# Altium schematic sheet 201_USB3Hub.SchDoc: USB Control Hub
size A2; Organization: Greenfield Tech Solutions; Address1: Molendreef 33; Address2: Ossendrecht; Address3: 4641CS; Address4: The Netherlands; SheetNumber: 3; SheetTotal: 8
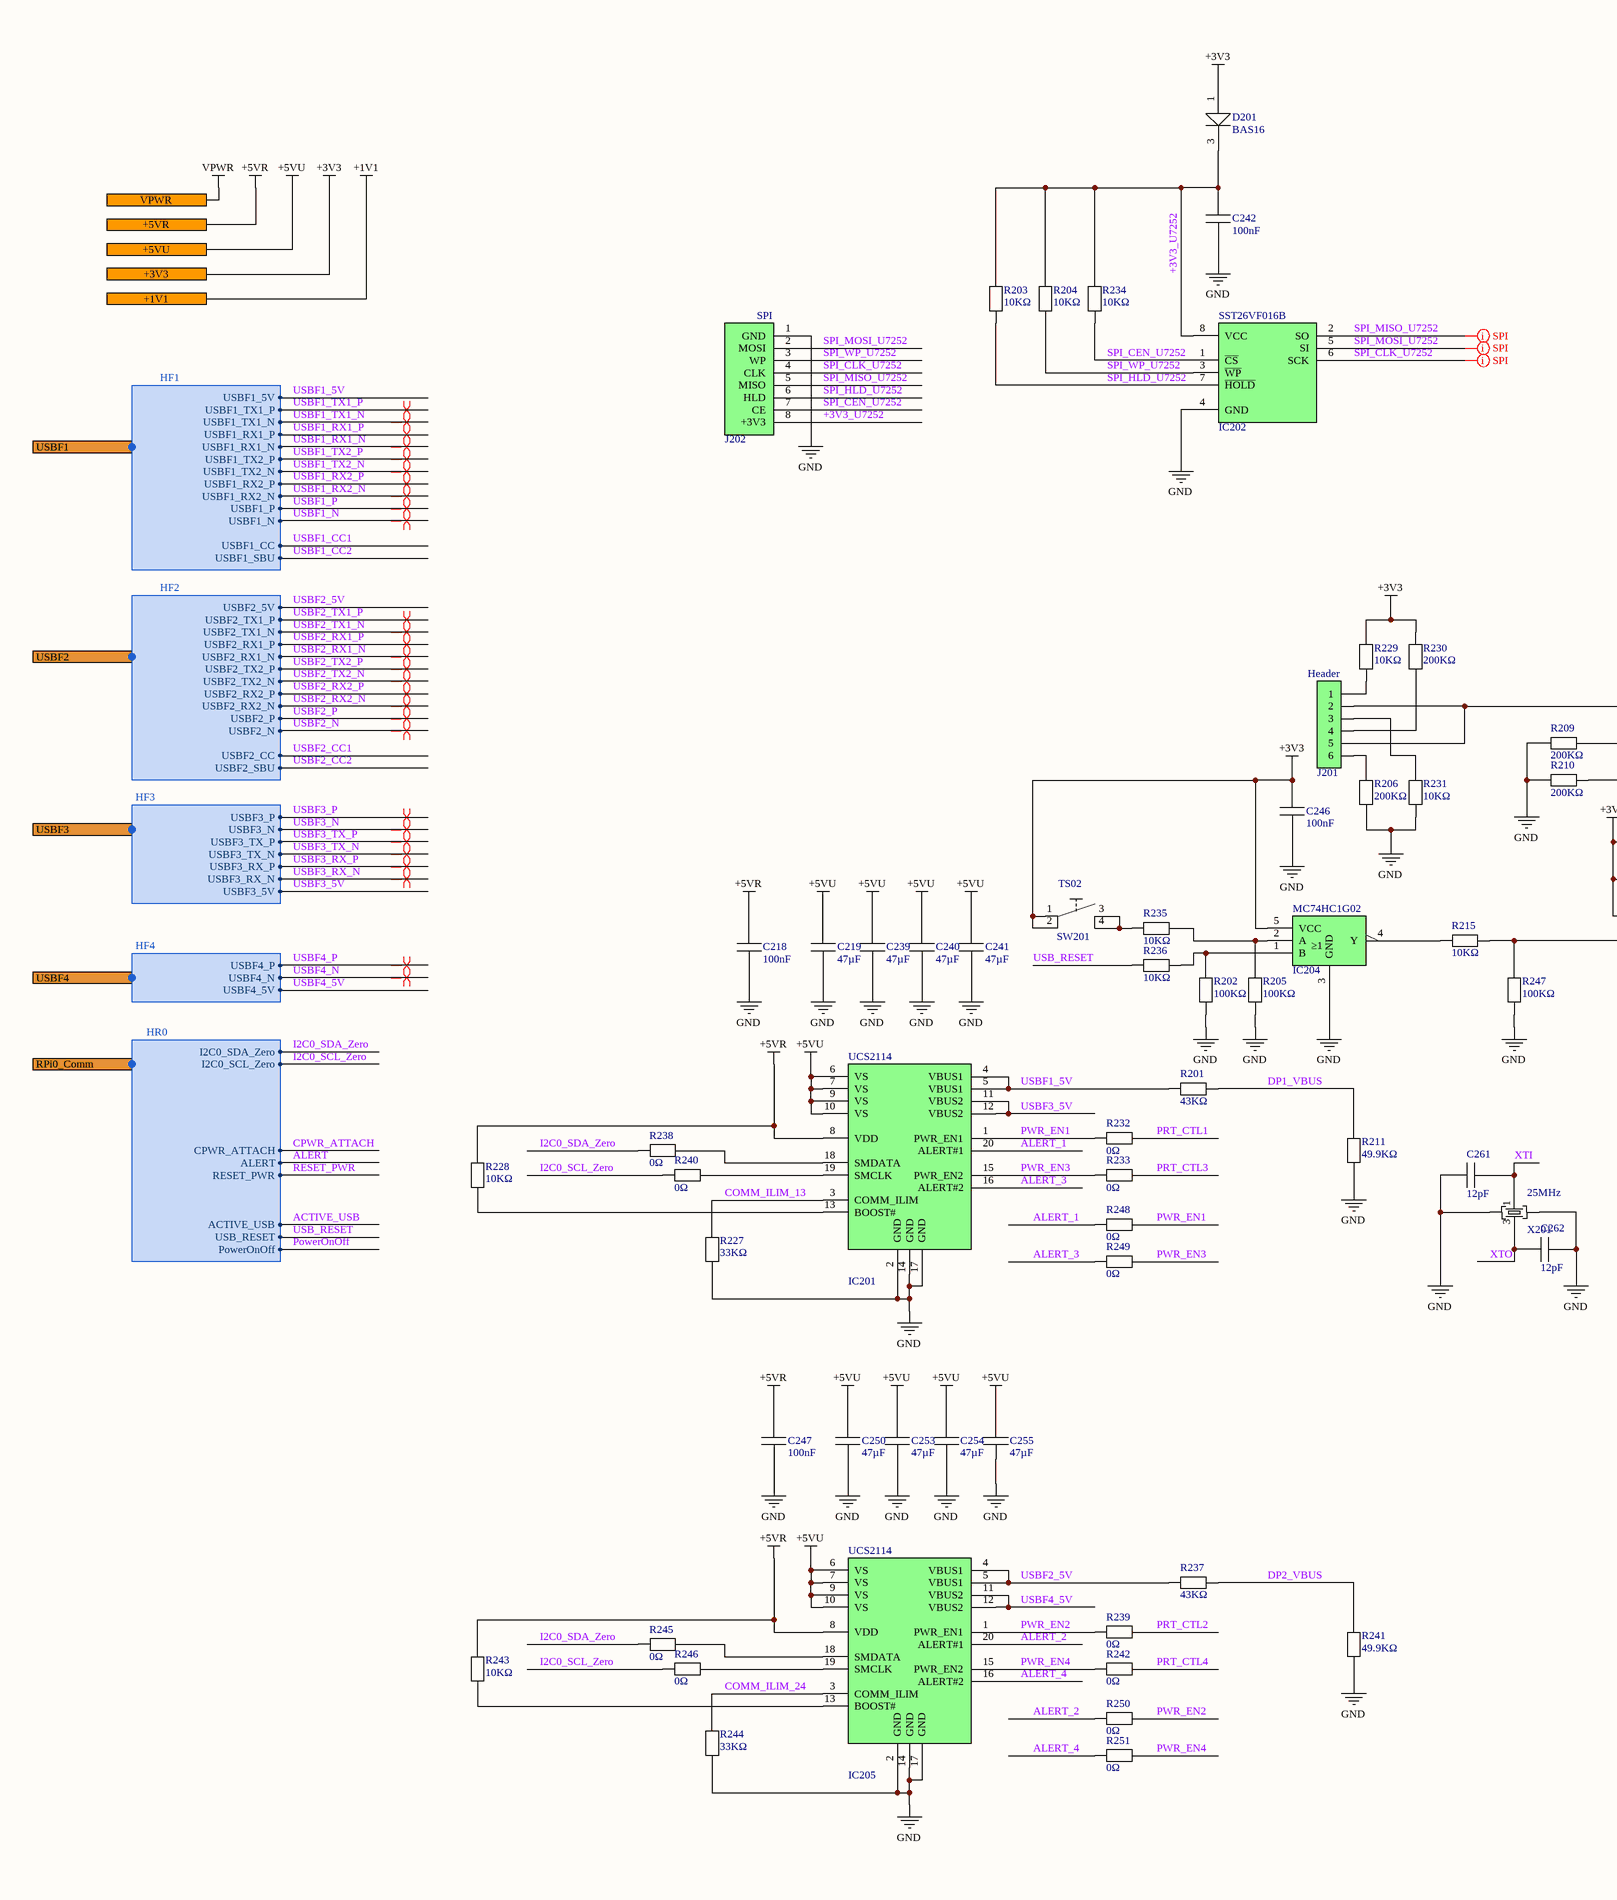
[diagram p0: 201_USB3Hub.SchDoc, left]
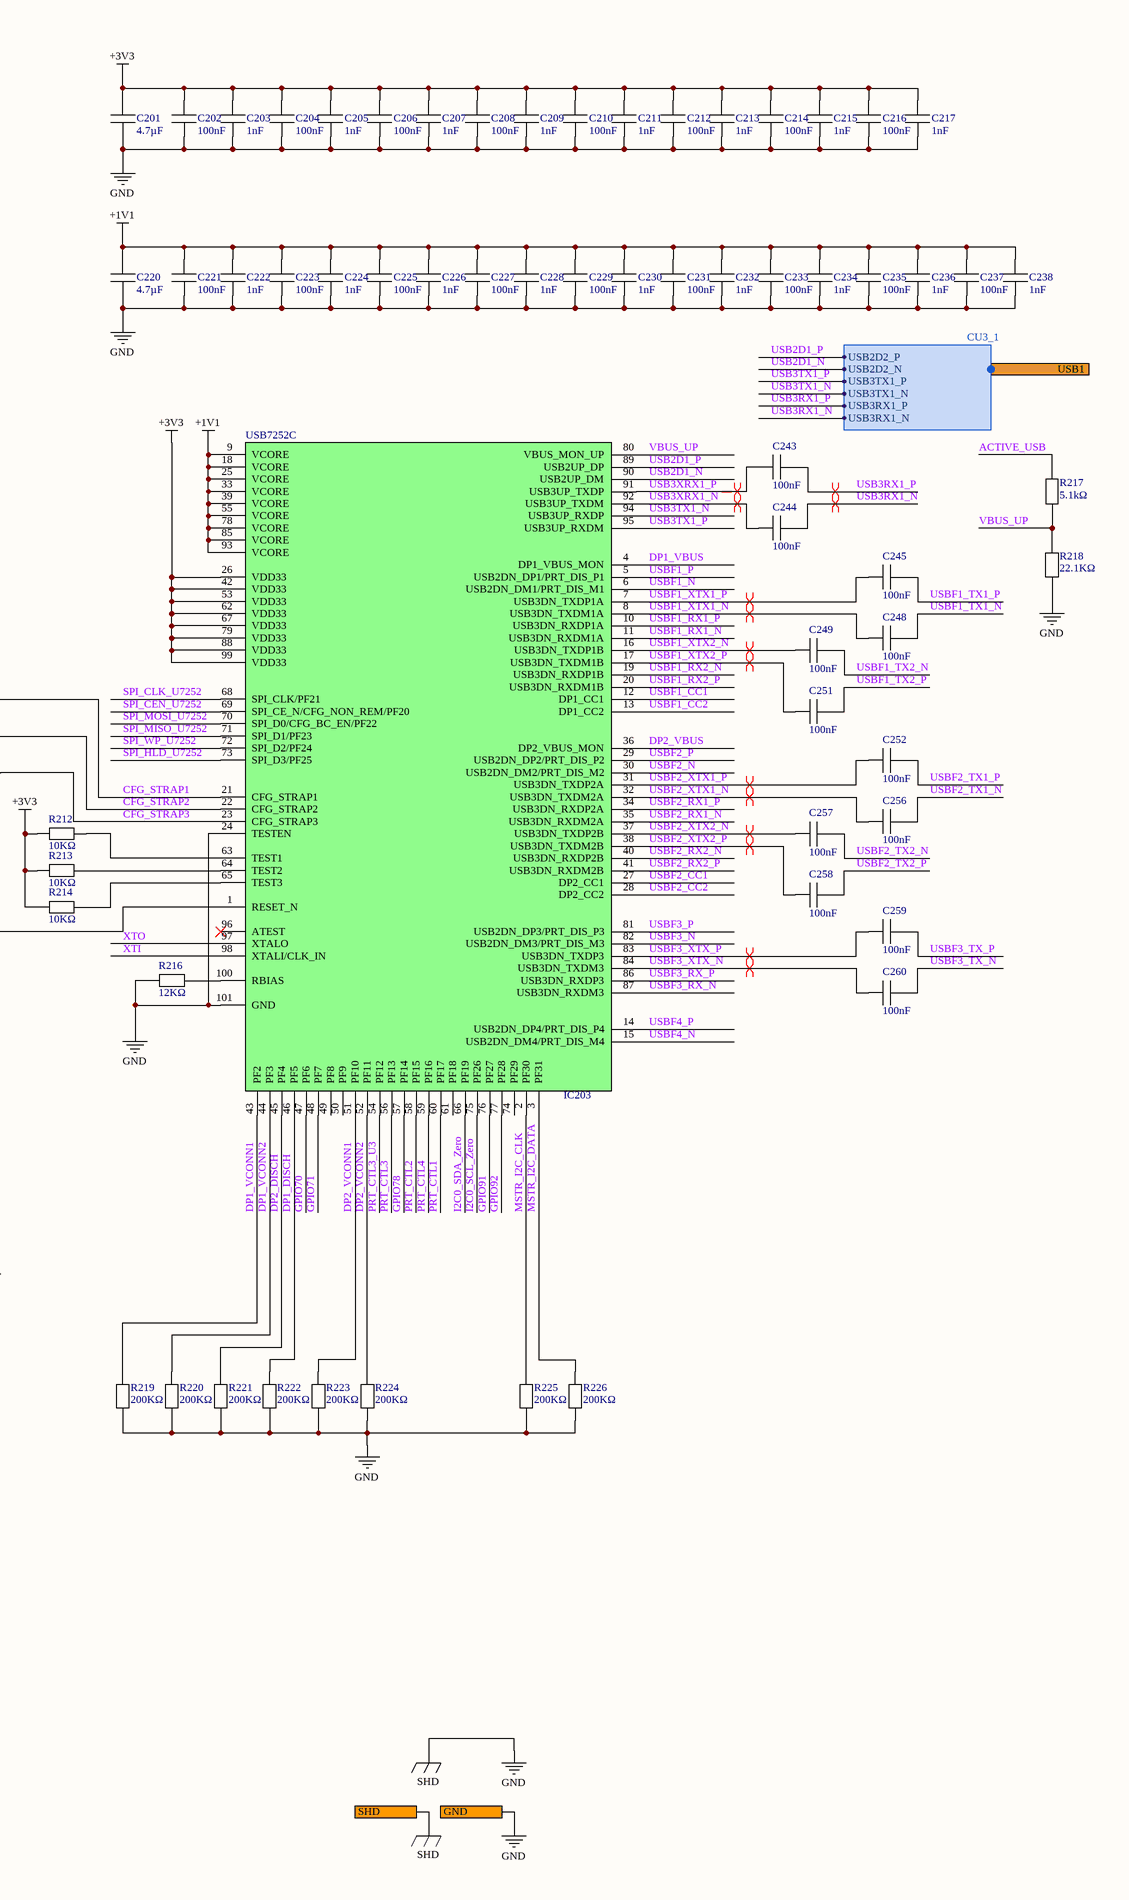
[diagram p1: 201_USB3Hub.SchDoc, right]

## Parts
C201  4.7µF  [C0603]
C202  100nF  [C0402]
C203  1nF  [C0402]
C204  100nF  [C0402]
C205  1nF  [C0402]
C206  100nF  [C0402]
C207  1nF  [C0402]
C208  100nF  [C0402]
C209  1nF  [C0402]
C210  100nF  [C0402]
C211  1nF  [C0402]
C212  100nF  [C0402]
C213  1nF  [C0402]
C214  100nF  [C0402]
C215  1nF  [C0402]
C216  100nF  [C0402]
C217  1nF  [C0402]
C218  100nF  [C0402]
C219  47µF  [C1210]
C220  4.7µF  [C0603]
C221  100nF  [C0402]
C222  1nF  [C0402]
C223  100nF  [C0402]
C224  1nF  [C0402]
C225  100nF  [C0402]
C226  1nF  [C0402]
C227  100nF  [C0402]
C228  1nF  [C0402]
C229  100nF  [C0402]
C230  1nF  [C0402]
C231  100nF  [C0402]
C232  1nF  [C0402]
C233  100nF  [C0402]
C234  1nF  [C0402]
C235  100nF  [C0402]
C236  1nF  [C0402]
C237  100nF  [C0402]
C238  1nF  [C0402]
C239  47µF  [C1210]
C240  47µF  [C1210]
C241  47µF  [C1210]
C242  100nF  [C0402]
C243  100nF  [C0402]
C244  100nF  [C0402]
C245  100nF  [C0402]
C246  100nF  [C0402]
C247  100nF  [C0402]
C248  100nF  [C0402]
C249  100nF  [C0402]
C250  47µF  [C1210]
C251  100nF  [C0402]
C252  100nF  [C0402]
C253  47µF  [C1210]
C254  47µF  [C1210]
C255  47µF  [C1210]
C256  100nF  [C0402]
C257  100nF  [C0402]
C258  100nF  [C0402]
C259  100nF  [C0402]
C260  100nF  [C0402]
C261  12pF  [C0402]
C262  12pF  [C0402]
D201  BAS16  [SOT-23]
IC201  UCS2114  [VQFN-20_3X3]
IC202  SST26VF016B  [SO-8]
IC203  USB7252C  [VQFN-100G_12X12]
IC204  MC74HC1G02  [TSOP-5]
IC205  UCS2114  [VQFN-20_3X3]
J201  Header  [1X6P_2.54MM_SMT]
J202  SPI  [SPI_PROG_TYPE1]
R201  43KΩ  [R0402]
R202  100KΩ  [R0402]
R203  10KΩ  [R0402]
R204  10KΩ  [R0402]
R205  100KΩ  [R0402]
R206  200KΩ  [R0402]
R209  200KΩ  [R0402]
R210  200KΩ  [R0402]
R211  49.9KΩ  [R0402]
R212  10KΩ  [R0402]
R213  10KΩ  [R0402]
R214  10KΩ  [R0402]
R215  10KΩ  [R0402]
R216  12KΩ  [R0402]
R217  5.1kΩ  [R0402]
R218  22.1KΩ  [R0603]
R219  200KΩ  [R0402]
R220  200KΩ  [R0402]
R221  200KΩ  [R0402]
R222  200KΩ  [R0402]
R223  200KΩ  [R0402]
R224  200KΩ  [R0402]
R225  200KΩ  [R0402]
R226  200KΩ  [R0402]
R227  33KΩ  [R0402]
R228  10KΩ  [R0402]
R229  10KΩ  [R0402]
R230  200KΩ  [R0402]
R231  10KΩ  [R0402]
R232  0Ω  [R0402]
R233  0Ω  [R0402]
R234  10KΩ  [R0402]
R235  10KΩ  [R0402]
R236  10KΩ  [R0402]
R237  43KΩ  [R0402]
R238  0Ω  [R0402]
R239  0Ω  [R0402]
R240  0Ω  [R0402]
R241  49.9KΩ  [R0402]
R242  0Ω  [R0402]
R243  10KΩ  [R0402]
R244  33KΩ  [R0402]
R245  0Ω  [R0402]
R246  0Ω  [R0402]
R247  100KΩ  [R0402]
R248  0Ω  [R0402]
R249  0Ω  [R0402]
R250  0Ω  [R0402]
R251  0Ω  [R0402]
SW201  TS02  [TS02]
X201  25MHz  [403W]

## Ports
+1V1, +3V3, +5VR, +5VU, GND, RPi0_Comm (harness HR0), SHD, USB1 (harness CU3_1), USBF1 (harness HF1), USBF2 (harness HF2), USBF3 (harness HF3), USBF4 (harness HF4), VPWR

## Harnesses
HF1: USBF1_5V, USBF1_TX1_P, USBF1_TX1_N, USBF1_RX1_P, USBF1_RX1_N, USBF1_CC, USBF1_SBU, USBF1_RX2_P, USBF1_RX2_N, USBF1_TX2_P, USBF1_TX2_N, USBF1_N, USBF1_P
CU3_1: USB2D2_N, USB2D2_P, USB3TX1_N, USB3TX1_P, USB3RX1_N, USB3RX1_P
HF2: USBF2_5V, USBF2_TX1_P, USBF2_TX1_N, USBF2_RX1_P, USBF2_RX1_N, USBF2_CC, USBF2_SBU, USBF2_RX2_P, USBF2_RX2_N, USBF2_TX2_P, USBF2_TX2_N, USBF2_N, USBF2_P
HF4: USBF4_N, USBF4_P, USBF4_5V
HR0: I2C0_SCL_Zero, I2C0_SDA_Zero, CPWR_ATTACH, PowerOnOff, USB_RESET, ACTIVE_USB, ALERT, RESET_PWR
HF3: USBF3_N, USBF3_P, USBF3_TX_N, USBF3_TX_P, USBF3_RX_N, USBF3_RX_P, USBF3_5V

## Nets
+1V1: C220.1 C221.1 C222.1 C223.1 C224.1 C225.1 C226.1 C227.1 C228.1 C229.1 C230.1 C231.1 C232.1 C233.1 C234.1 C235.1 C236.1 C237.1 C238.1 IC203.9(VCORE) IC203.18(VCORE) IC203.25(VCORE) IC203.33(VCORE) IC203.39(VCORE) IC203.55(VCORE) IC203.78(VCORE) IC203.85(VCORE) IC203.93(VCORE) ; port +1V1
+3V3: C201.1 C202.1 C203.1 C204.1 C205.1 C206.1 C207.1 C208.1 C209.1 C210.1 C211.1 C212.1 C213.1 C214.1 C215.1 C216.1 C217.1 C246.1 D201.1(A) IC203.26(VDD33) IC203.42(VDD33) IC203.53(VDD33) IC203.62(VDD33) IC203.67(VDD33) IC203.79(VDD33) IC203.88(VDD33) IC203.99(VDD33) IC204.5(VCC) R212.1 R213.1 R214.1 R229.2 R230.1 SW201.1 SW201.2 ; port +3V3
+5VR: C218.1 C247.1 IC201.8(VDD) IC205.8(VDD) R228.2 R243.2 ; port +5VR
+5VU: C219.1 C239.1 C240.1 C241.1 C250.1 C253.1 C254.1 C255.1 IC201.6(VS) IC201.7(VS) IC201.9(VS) IC201.10(VS) IC205.6(VS) IC205.7(VS) IC205.9(VS) IC205.10(VS) ; port +5VU
GND: C201.2 C202.2 C203.2 C204.2 C205.2 C206.2 C207.2 C208.2 C209.2 C210.2 C211.2 C212.2 C213.2 C214.2 C215.2 C216.2 C217.2 C218.2 C219.2 C220.2 C221.2 C222.2 C223.2 C224.2 C225.2 C226.2 C227.2 C228.2 C229.2 C230.2 C231.2 C232.2 C233.2 C234.2 C235.2 C236.2 C237.2 C238.2 C239.2 C240.2 C241.2 C242.2 C246.2 C247.2 C250.2 C253.2 C254.2 C255.2 C261.1 C262.2 IC201.2(GND) IC201.14(GND) IC201.17(GND) IC202.4(GND) IC203.24(TESTEN) IC203.101(GND) IC204.3(GND) IC205.2(GND) IC205.14(GND) IC205.17(GND) J202.1(GND) R202.1 R205.1 R206.2 R209.1 R210.1 R211.1 R216.1 R218.1 R219.1 R220.1 R221.1 R222.1 R223.1 R224.1 R225.1 R226.1 R227.1 R231.1 R241.1 R244.1 R247.1 X201.2 X201.4 ; port GND, port SHD  [also labelled SHD]
VPWR: port VPWR
+3V3_U7252: C242.1 D201.3(K) IC202.8(VCC) J202.8(+3V3) R203.2 R204.2 R234.2
ACTIVE_USB: R217.2 ; port RPi0_Comm.ACTIVE_USB
ALERT: port RPi0_Comm.ALERT
ALERT_1: IC201.20(ALERT#1) R248.1
ALERT_2: IC205.20(ALERT#1) R250.1
ALERT_3: IC201.16(ALERT#2) R249.1
ALERT_4: IC205.16(ALERT#2) R251.1
CFG_STRAP1: IC203.21(CFG_STRAP1) J201.2 J201.5
CFG_STRAP2: IC203.22(CFG_STRAP2) R209.2
CFG_STRAP3: IC203.23(CFG_STRAP3) R210.2
COMM_ILIM_13: IC201.3(COMM_ILIM) R227.2
COMM_ILIM_24: IC205.3(COMM_ILIM) R244.2
CPWR_ATTACH: port RPi0_Comm.CPWR_ATTACH
DP1_DISCH: IC203.46(PF5) R222.2
DP1_VBUS: IC203.4(DP1_VBUS_MON) R201.2 R211.2
DP1_VCONN1: IC203.43(PF2) R219.2
DP1_VCONN2: IC203.44(PF3) R220.2
DP2_DISCH: IC203.45(PF4) R221.2
DP2_VBUS: IC203.36(DP2_VBUS_MON) R237.2 R241.2
DP2_VCONN1: IC203.51(PF10) R223.2
DP2_VCONN2: IC203.52(PF11) R224.2
GPIO70: IC203.47(PF6)
GPIO71: IC203.48(PF7)
GPIO78: IC203.57(PF14)
GPIO91: IC203.76(PF27)
GPIO92: IC203.77(PF28)
I2C0_SCL_Zero: IC203.75(PF26) R240.1 R246.1 ; port RPi0_Comm.I2C0_SCL_Zero
I2C0_SDA_Zero: IC203.66(PF19) R238.1 R245.1 ; port RPi0_Comm.I2C0_SDA_Zero
MSTR_I2C_CLK: IC203.2(PF30) R225.2
MSTR_I2C_DATA: IC203.3(PF31) R226.2
PowerOnOff: port RPi0_Comm.PowerOnOff
PRT_CTL1: IC203.60(PF17) R232.2
PRT_CTL2: IC203.58(PF15) R239.2
PRT_CTL3: IC203.56(PF13) R233.2
PRT_CTL3_U3: IC203.54(PF12)
PRT_CTL4: IC203.59(PF16) R242.2
PWR_EN1: IC201.1(PWR_EN1) R232.1 R248.2
PWR_EN2: IC205.1(PWR_EN1) R239.1 R250.2
PWR_EN3: IC201.15(PWR_EN2) R233.1 R249.2
PWR_EN4: IC205.15(PWR_EN2) R242.1 R251.2
RESET_PWR: port RPi0_Comm.RESET_PWR
SPI_CEN_U7252: IC202.1(~{CS}) IC203.69(SPI_CE_N/CFG_NON_REM/PF20) J202.7(CE) R234.1
SPI_CLK_U7252: IC202.6(SCK) IC203.68(SPI_CLK/PF21) J202.4(CLK)
SPI_HLD_U7252: IC202.7(~{HOLD}) IC203.73(SPI_D3/PF25) J202.6(HLD) R203.1
SPI_MISO_U7252: IC202.2(SO) IC203.71(SPI_D1/PF23) J202.5(MISO)
SPI_MOSI_U7252: IC202.5(SI) IC203.70(SPI_D0/CFG_BC_EN/PF22) J202.2(MOSI)
SPI_WP_U7252: IC202.3(~{WP}) IC203.72(SPI_D2/PF24) J202.3(WP) R204.1
USB2D1_N: IC203.90(USB2UP_DM) ; port USB1.USB2D2_N
USB2D1_P: IC203.89(USB2UP_DP) ; port USB1.USB2D2_P
USB3RX1_N: C244.2 ; port USB1.USB3RX1_N
USB3RX1_P: C243.2 ; port USB1.USB3RX1_P
USB3TX1_N: IC203.94(USB3UP_RXDP) ; port USB1.USB3TX1_N
USB3TX1_P: IC203.95(USB3UP_RXDM) ; port USB1.USB3TX1_P
USB3XRX1_N: C244.1 IC203.92(USB3UP_TXDM)
USB3XRX1_P: C243.1 IC203.91(USB3UP_TXDP)
USB_RESET: R236.2 ; port RPi0_Comm.USB_RESET
USBF1_5V: IC201.4(VBUS1) IC201.5(VBUS1) R201.1 ; port USBF1.USBF1_5V
USBF1_CC1: IC203.12(DP1_CC1) ; port USBF1.USBF1_CC
USBF1_CC2: IC203.13(DP1_CC2) ; port USBF1.USBF1_SBU
USBF1_N: IC203.6(USB2DN_DM1/PRT_DIS_M1) ; port USBF1.USBF1_N
USBF1_P: IC203.5(USB2DN_DP1/PRT_DIS_P1) ; port USBF1.USBF1_P
USBF1_RX1_N: IC203.11(USB3DN_RXDM1A) ; port USBF1.USBF1_RX1_N
USBF1_RX1_P: IC203.10(USB3DN_RXDP1A) ; port USBF1.USBF1_RX1_P
USBF1_RX2_N: IC203.19(USB3DN_RXDP1B) ; port USBF1.USBF1_RX2_N
USBF1_RX2_P: IC203.20(USB3DN_RXDM1B) ; port USBF1.USBF1_RX2_P
USBF1_TX1_N: C248.2 ; port USBF1.USBF1_TX1_N
USBF1_TX1_P: C245.2 ; port USBF1.USBF1_TX1_P
USBF1_TX2_N: C249.2 ; port USBF1.USBF1_TX2_N
USBF1_TX2_P: C251.2 ; port USBF1.USBF1_TX2_P
USBF1_XTX1_N: C248.1 IC203.8(USB3DN_TXDM1A)
USBF1_XTX1_P: C245.1 IC203.7(USB3DN_TXDP1A)
USBF1_XTX2_N: C249.1 IC203.16(USB3DN_TXDP1B)
USBF1_XTX2_P: C251.1 IC203.17(USB3DN_TXDM1B)
USBF2_5V: IC205.4(VBUS1) IC205.5(VBUS1) R237.1 ; port USBF2.USBF2_5V
USBF2_CC1: IC203.27(DP2_CC1) ; port USBF2.USBF2_CC
USBF2_CC2: IC203.28(DP2_CC2) ; port USBF2.USBF2_SBU
USBF2_N: IC203.30(USB2DN_DM2/PRT_DIS_M2) ; port USBF2.USBF2_N
USBF2_P: IC203.29(USB2DN_DP2/PRT_DIS_P2) ; port USBF2.USBF2_P
USBF2_RX1_N: IC203.35(USB3DN_RXDM2A) ; port USBF2.USBF2_RX1_N
USBF2_RX1_P: IC203.34(USB3DN_RXDP2A) ; port USBF2.USBF2_RX1_P
USBF2_RX2_N: IC203.40(USB3DN_RXDP2B) ; port USBF2.USBF2_RX2_N
USBF2_RX2_P: IC203.41(USB3DN_RXDM2B) ; port USBF2.USBF2_RX2_P
USBF2_TX1_N: C256.2 ; port USBF2.USBF2_TX1_N
USBF2_TX1_P: C252.2 ; port USBF2.USBF2_TX1_P
USBF2_TX2_N: C257.2 ; port USBF2.USBF2_TX2_N
USBF2_TX2_P: C258.2 ; port USBF2.USBF2_TX2_P
USBF2_XTX1_N: C256.1 IC203.32(USB3DN_TXDM2A)
USBF2_XTX1_P: C252.1 IC203.31(USB3DN_TXDP2A)
USBF2_XTX2_N: C257.1 IC203.37(USB3DN_TXDP2B)
USBF2_XTX2_P: C258.1 IC203.38(USB3DN_TXDM2B)
USBF3_5V: IC201.11(VBUS2) IC201.12(VBUS2) ; port USBF3.USBF3_5V
USBF3_N: IC203.82(USB2DN_DM3/PRT_DIS_M3) ; port USBF3.USBF3_N
USBF3_P: IC203.81(USB2DN_DP3/PRT_DIS_P3) ; port USBF3.USBF3_P
USBF3_RX_N: IC203.87(USB3DN_RXDM3) ; port USBF3.USBF3_RX_N
USBF3_RX_P: IC203.86(USB3DN_RXDP3) ; port USBF3.USBF3_RX_P
USBF3_TX_N: C260.2 ; port USBF3.USBF3_TX_N
USBF3_TX_P: C259.2 ; port USBF3.USBF3_TX_P
USBF3_XTX_N: C260.1 IC203.84(USB3DN_TXDM3)
USBF3_XTX_P: C259.1 IC203.83(USB3DN_TXDP3)
USBF4_5V: IC205.11(VBUS2) IC205.12(VBUS2) ; port USBF4.USBF4_5V
USBF4_N: IC203.15(USB2DN_DM4/PRT_DIS_M4) ; port USBF4.USBF4_N
USBF4_P: IC203.14(USB2DN_DP4/PRT_DIS_P4) ; port USBF4.USBF4_P
VBUS_UP: IC203.80(VBUS_MON_UP) R217.1 R218.2
XTI: C261.2 IC203.98(XTALI/CLK_IN) X201.1
XTO: C262.1 IC203.97(XTALO) X201.3
NetIC201_13: IC201.13(BOOST#) R228.1
NetIC201_18: IC201.18(SMDATA) R238.2
NetIC201_19: IC201.19(SMCLK) R240.2
NetIC203_1: IC203.1(RESET_N) R215.2 R247.2
NetIC203_63: IC203.63(TEST1) R212.2
NetIC203_64: IC203.64(TEST2) R213.2
NetIC203_65: IC203.65(TEST3) R214.2
NetIC203_100: IC203.100(RBIAS) R216.2
NetIC204_1: IC204.1(B) R202.2 R236.1
NetIC204_2: IC204.2(A) R205.2 R235.1
NetIC204_4: IC204.4(Y) R215.1
NetIC205_13: IC205.13(BOOST#) R243.1
NetIC205_18: IC205.18(SMDATA) R245.2
NetIC205_19: IC205.19(SMCLK) R246.2
NetJ201_1: J201.1 R229.1
NetJ201_3: J201.3 R231.2
NetJ201_4: J201.4 R230.2
NetJ201_6: J201.6 R206.1
NetR235_2: R235.2 SW201.3 SW201.4

Not connected (* = marked no-connect by the designer): IC203 49(PF8) 50(PF9) 61(PF18) 74(PF29) 96(ATEST)*

## Layout directives
differential pair; differential pair class USB3: USB3RX1_N, USB3RX1_P, USB3XRX1_N, USB3XRX1_P, USBF1_N, USBF1_P, USBF1_RX1_N, USBF1_RX1_P, USBF1_RX2_N, USBF1_RX2_P, USBF1_TX1_N, USBF1_TX1_P, USBF1_TX2_N, USBF1_TX2_P, USBF1_XTX1_N, USBF1_XTX1_P, USBF1_XTX2_N, USBF1_XTX2_P, USBF2_N, USBF2_P, USBF2_RX1_N, USBF2_RX1_P, USBF2_RX2_N, USBF2_RX2_P, USBF2_TX1_N, USBF2_TX1_P, USBF2_TX2_N, USBF2_TX2_P, USBF2_XTX1_N, USBF2_XTX1_P, USBF2_XTX2_N, USBF2_XTX2_P, USBF3_N, USBF3_P, USBF3_RX_N, USBF3_RX_P, USBF3_TX_N, USBF3_TX_P, USBF3_XTX_N, USBF3_XTX_P, USBF4_N, USBF4_P
net class SPI_USB7252C: SPI_CLK_U7252, SPI_MISO_U7252, SPI_MOSI_U7252

## Notes on the sheet
- Title
- Size:
- Date:
- File:
- A2
- Number:
- Time:
- Revision:
- Sheet
- of
- (in symbol IC0061) ≥1

## Library data of the parts
C201 C220 = CA0002: 4.7µF 16V 10% X5R; Part Number: CA0002; ManfactPart: C1608X5R1C475K080AC; ID: 2; RefVal: 4.7µF
C202 C204 C206 C208 C210 C212 C214 C216 C218 C221 C223 C225 C227 C229 C231 C233 C235 C237 C242-C249 C251 C252 C256-C260 = CA0010: 100nF 16V 10% X7R; Part Number: CA0010; ManfactPart: GCM155R71C104KA55D; ID: 10; RefVal: 100nF
C203 C205 C207 C209 C211 C213 C215 C217 C222 C224 C226 C228 C230 C232 C234 C236 C238 = CA0031: 1nF 50V 1% C0G; Part Number: CA0031; ManfactPart: GRT1555C1H102FA02D; ID: 31; RefVal: 1nF
C219 C239-C241 C250 C253-C255 = CA0007: 47µF 16V 20% X5R; Part Number: CA0007; ManfactPart: EMK325ABJ476MM8P; ID: 7; RefVal: 47µF
C261 C262 = CA0059: 12pF 16V 1% C0G; Part Number: CA0059; ManfactPart: VJ0402A120FXJCW1BC; ID: 59; RefVal: 12pF
D201 = DI0010: Diodes - General Purpose, Power, Switching 100Vll Signal Switching Diodes 2A; Part Number: DI0010; ManfactPart: BAS16_R1_00001; ID: 10; RefVal: BAS16
IC201 IC205 = IC0056: Dual USB Power Switch with Integrated Current Sensor; Part Number: IC0056; ID: 56; RefVal: UCS2114; ManfactPart: UCS2114
IC202 = IC0059: 16 Mbit Serial Quad I/O (SQI) Flash Memory; Part Number: IC0059; ManfactPart: SST26VF016B-104V/SN; ID: 59; RefVal: SST26VF016B
IC203 = IC0047: 4-Port USB 3.2 Gen 2 Type-C Controller Hub; Part Number: IC0047; ID: 47; RefVal: USB7252C; ManfactPart: USB7252C
IC204 = IC0061: Logic Gates 2-6V Single 2-Input NOR; Part Number: IC0061; ManfactPart: MC74HC1G02DTT1G; ID: 61; RefVal: MC74HC1G02
J201 = CO0043: Header 1x6P SMT Mount; Part Number: CO0043; ManfactPart: G800MJ302018EU; ID: 43; RefVal: Header
J202 = ME0028: SPI Programming connection; Part Number: ME0028; ID: 28; RefVal: SPI
R201 R237 = RS0076: 43KΩ 1% 62.5mW 100PPM; Part Number: RS0076; ManfactPart: CRCW040243K0FKEDC; ID: 76; RefVal: 43KΩ
R202 R205 R247 = RS0036: 100KΩ 1% 62.5mW 100PPM; Part Number: RS0036; ManfactPart: AC0402FR-13100KL; ID: 36; RefVal: 100KΩ
R203 R204 R212-R215 R228 R229 R231 R234-R236 R243 = RS0011: 10KΩ 1% 62.5mW; Part Number: RS0011; ManfactPart: WR04X1002FTL; ID: 11; RefVal: 10KΩ
R206 R209 R210 R219-R226 R230 = RS0045: 200KΩ 1% 62.5mW 100PPM; Part Number: RS0045; ManfactPart: CRG0402F200K; ID: 45; RefVal: 200KΩ
R211 R241 = RS0077: 49.9KΩ 1% 62.5mW 100PPM; Part Number: RS0077; ManfactPart: 0402WGF4992TCE; ID: 77; RefVal: 49.9KΩ
R216 = RS0015: 12KΩ 1% 62.5mW; Part Number: RS0015; ManfactPart: RC0402FR-1312KL; ID: 15; RefVal: 12KΩ
R217 = RS0038: 5.1KΩ 1% 62.5mW 100PPM; Part Number: RS0038; ManfactPart: CRCW04025K10FKEDC; ID: 38; RefVal: 5.1kΩ
R218 = RS0040: 22.1KΩ 1% 100mW 100PPM; Part Number: RS0040; ManfactPart: RC0603FR-0722K1L; ID: 40; RefVal: 22.1KΩ
R227 R244 = RS0075: 33KΩ 1% 62.5mW 100PPM; Part Number: RS0075; ManfactPart: 0402WGF3302TCE; ID: 75; RefVal: 33KΩ
R232 R233 R238-R240 R242 R245 R246 R248-R251 = RS0074: 0Ω 62.5mW; Part Number: RS0074; ManfactPart: 0402WGJ0000TCE; ID: 74; RefVal: 0Ω
SW201 = SW0005: TACTILE SWITCH SPST; Part Number: SW0005; ManfactPart: TS02-66-50-BK-160-SCR-D; ID: 5; RefVal: TS02
X201 = CR0003: 25MHz 8pF 20PPM; Part Number: CR0003; ManfactPart: 403WF25012IK; ID: 3; RefVal: 25MHz